# Altium project PCB_Project.PrjPcb
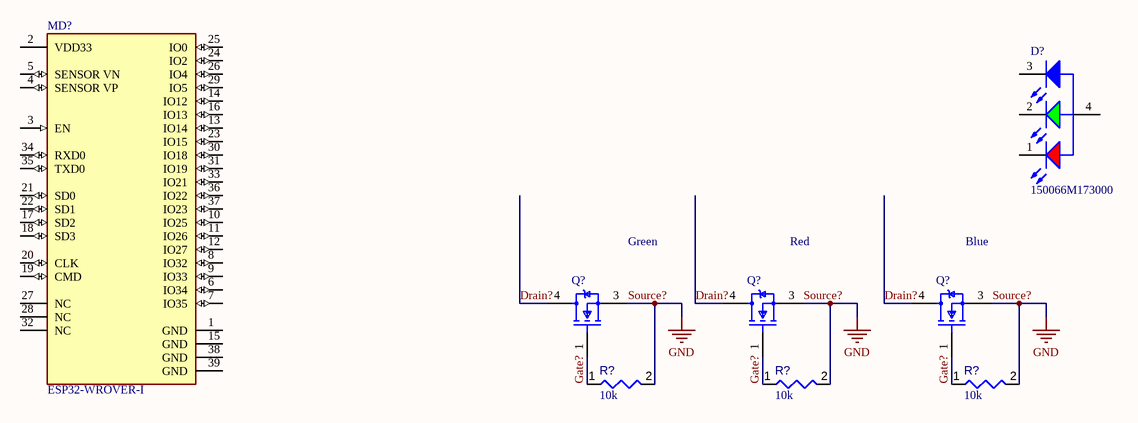
[diagram p0: conceptSimpleLedDriver.SchDoc]
1 sheet, 8 parts. Net scope: global (net labels, ports and power ports of the same name join across sheets).

## Sheet conceptSimpleLedDriver.SchDoc
size A4; SheetNumber: 1; SheetTotal: 1

### Parts
(Parts that share a designator on the sheet are numbered #1, #2 ... from top to bottom, then left to right.)
D?  150066M173000  [WL-SFCW_0606_L1.6W1.6H0.4]
MD?  ESP32-WROVER-I  [FP-ESP32-WROVER-I-MFG]
Q?#1  IRF540NSTRLPBF  [FP-PG-TO263-3-MFG]  (value not drawn)
Q?#2  IRF540NSTRLPBF  [FP-PG-TO263-3-MFG]  (value not drawn)
Q?#3  IRF540NSTRLPBF  [FP-PG-TO263-3-MFG]  (value not drawn)
R?#1  value 10k  [RESA60-630X240]  (hidden comment: MFR-25FBF52-10K)
R?#2  value 10k  [RESA60-630X240]  (hidden comment: MFR-25FBF52-10K)
R?#3  value 10k  [RESA60-630X240]  (hidden comment: MFR-25FBF52-10K)

### Nets
Source?: Q?#1.3(SOURCE) Q?#2.3(SOURCE) Q?#3.3(SOURCE) R?#1.2 R?#2.2 R?#3.2  [also labelled GND]
Drain?: Q?#1.4(DRAIN) Q?#2.4(DRAIN) Q?#3.4(DRAIN)
Gate?: Q?#1.1(GATE) Q?#2.1(GATE) Q?#3.1(GATE) R?#1.1 R?#2.1 R?#3.1

Not connected (* = marked no-connect by the designer): D? 1(K) 2(K) 3(K) 4(A); MD? 1(GND) 2(VDD33) 3(EN) 4(SENSOR_VP) 5(SENSOR_VN) 6(IO34) 7(IO35) 8(IO32) 9(IO33) 10(IO25) 11(IO26) 12(IO27) 13(IO14) 14(IO12) 15(GND) 16(IO13) 17(SD2) 18(SD3) 19(CMD) 20(CLK) 21(SD0) 22(SD1) 23(IO15) 24(IO2) 25(IO0) 26(IO4) 27(NC) 28(NC) 29(IO5) 30(IO18) 31(IO19) 32(NC) 33(IO21) 34(RXD0) 35(TXD0) 36(IO22) 37(IO23) 38(GND) 39(GND)

### Notes on the sheet
- Green
- Red
- Blue

### Library data of the parts
D? = CMP-03913-82270973-1: 150066M173000 WL-SFCW SMT Full-color Chip LED waterclear; Forward Current: 80mA; Power Dissipation: 48mW; Dominant Wavelength: 527nm; Peak Wavelength: 468nm; Luminous Intensity: 70mcd; Forward Voltage: 1.9V; Viewing Angle: 120°; Max Reverse Voltage (DC): 5V; Width: 1.6mm; Height: 400µm; Packaging: Tape and Reel; Min Operating Temperature: -40°C; Length: 1.6mm; RoHS: Compliant; Max Operating Temperature: 85°C; NexarPartId: 82270973
MD? = CMP-194065-000001-1: SMD MODULE, ESP32-D0WDQ6, 32MBIT; Manufacturer: Espressif; Number Of Adc Channels: 16; Min Supply Voltage: 2.3V; Interface: I2C,SPI,UART,I2S,Other; Max Frequency: 2484MHz; Nominal Supply Current: 500mA; Sensitivity: -98dBm; Max Supply Voltage: 3.6V; Number Of Gpio: 20; Data Rate: 150Mbits/s; Description: Bluetooth, WiFi 802.11b/g/n, Bluetooth v4.2 + EDR, Class 1, 2 and 3 Transceiver Module 2.4GHz ~ 2.5GHz Not Included, I-PEX Surface Mount; Package: ESP32-WROVER-I; Temperature Range Low: -40°C; Temperature Range High: +85°C; Device Class L1: Integrated Circuits (ICs); Category: UNK; ComponentLink2Description: Datasheet; Device Class L2: RF Semiconductors and Devices; Automotive: No; Lead Free: Yes; Octopart: https://octopart.com/esp32-wrover-i-espressif+systems-89171349; ComponentLink2URL: https://www.espressif.com/sites/default/files/documentation/esp32-wrover_datasheet_en.pdf; Temperature: -40°C to +85°C; Height: 3.4mm; RoHS: TRUE; Digikey Description: SMD MODULE, ESP32-D0WDQ6, 32MBIT; Device Class L3: Transceivers; Manufacturer Part Number: ESP32-WROVER-I
Q?#1-Q?#3 = CMP-00196-65873407-1: IRF540NSTRLPBF Transistor MOSFET N Channel 100 Volt 33 Amp 3-Pin 2+ Tab D2pak Tape And Reel; Drain to Source Voltage (Vdss): 100V; Rise Time: 35ns; Resistance: 44MΩ; Gate to Source Voltage (Vgs): 20V; Turn-Off Delay Time: 39ns; Recovery Time: 170ns; Number of Elements: 1; Max Junction Temperature (Tj): 175°C; Nominal Vgs: 4V; Element Configuration: Single; Current Rating: 33A; Power Dissipation: 3.8W; Turn-On Delay Time: 11ns; Input Capacitance: 1.96nF; Rds On Max: 8.4mΩ; Min Operating Temperature: -55°C; Lead Free: Lead Free; Packaging: Bulk; Voltage Rating (DC): 100V; Radiation Hardening: No; Height: 4.826mm; Schedule B: 8541290080, 8541290080; Mount: Surface Mount; Drain to Source Breakdown Voltage: 100V; Number of Pins: 3; Contact Plating: Tin; NexarPartId: 65873407; Max Operating Temperature: 175°C; Continuous Drain Current (ID): 33A; Termination: SMD/SMT; On-State Resistance: 44mΩ; Threshold Voltage: 4V; RoHS: Compliant; Dual Supply Voltage: 100V; Max Power Dissipation: 3.8W; Lifecycle Status: NRND; Width: 9.65mm; Drain to Source Resistance: 44mΩ; Fall Time: 35ns; Case/Package: D2PAK; Length: 10.668mm; Number of Channels: 1; Package Quantity: 800; REACH SVHC: No SVHC
R?#1-R?#3 = CMP-009-00047-4: Axial Resistor, 10 KOhm, +/- 1%, 0.25 W, -55 to 155 degC, 2-Pin THD, RoHS, Bulk; Manufacturer: Yageo; Power: 250mW; Voltage Rating: 250V; Manufacturer URL: http://www.yageo.com/; Datasheet URL: http://www.yageo.com/documents/recent/Yageo%20LR_MFR_2013.pdf; Package Reference: MFR-25; Min Operating Temperature: -55°C; Mounting Technology: TH; Package Quantity: 200; Case/Package: Axial; Tolerance: 1%; RoHS Compliant: True; Datasheet Version: Apr-13; Packaging: Bulk; Max Operating Temperature: 155°C; Package Description: 2-Pin Axial Lead, Dia 2.4 mm, Body Length 6.3 mm